# EAGLE design UP_Main_Board (EAGLE 9.6.2)
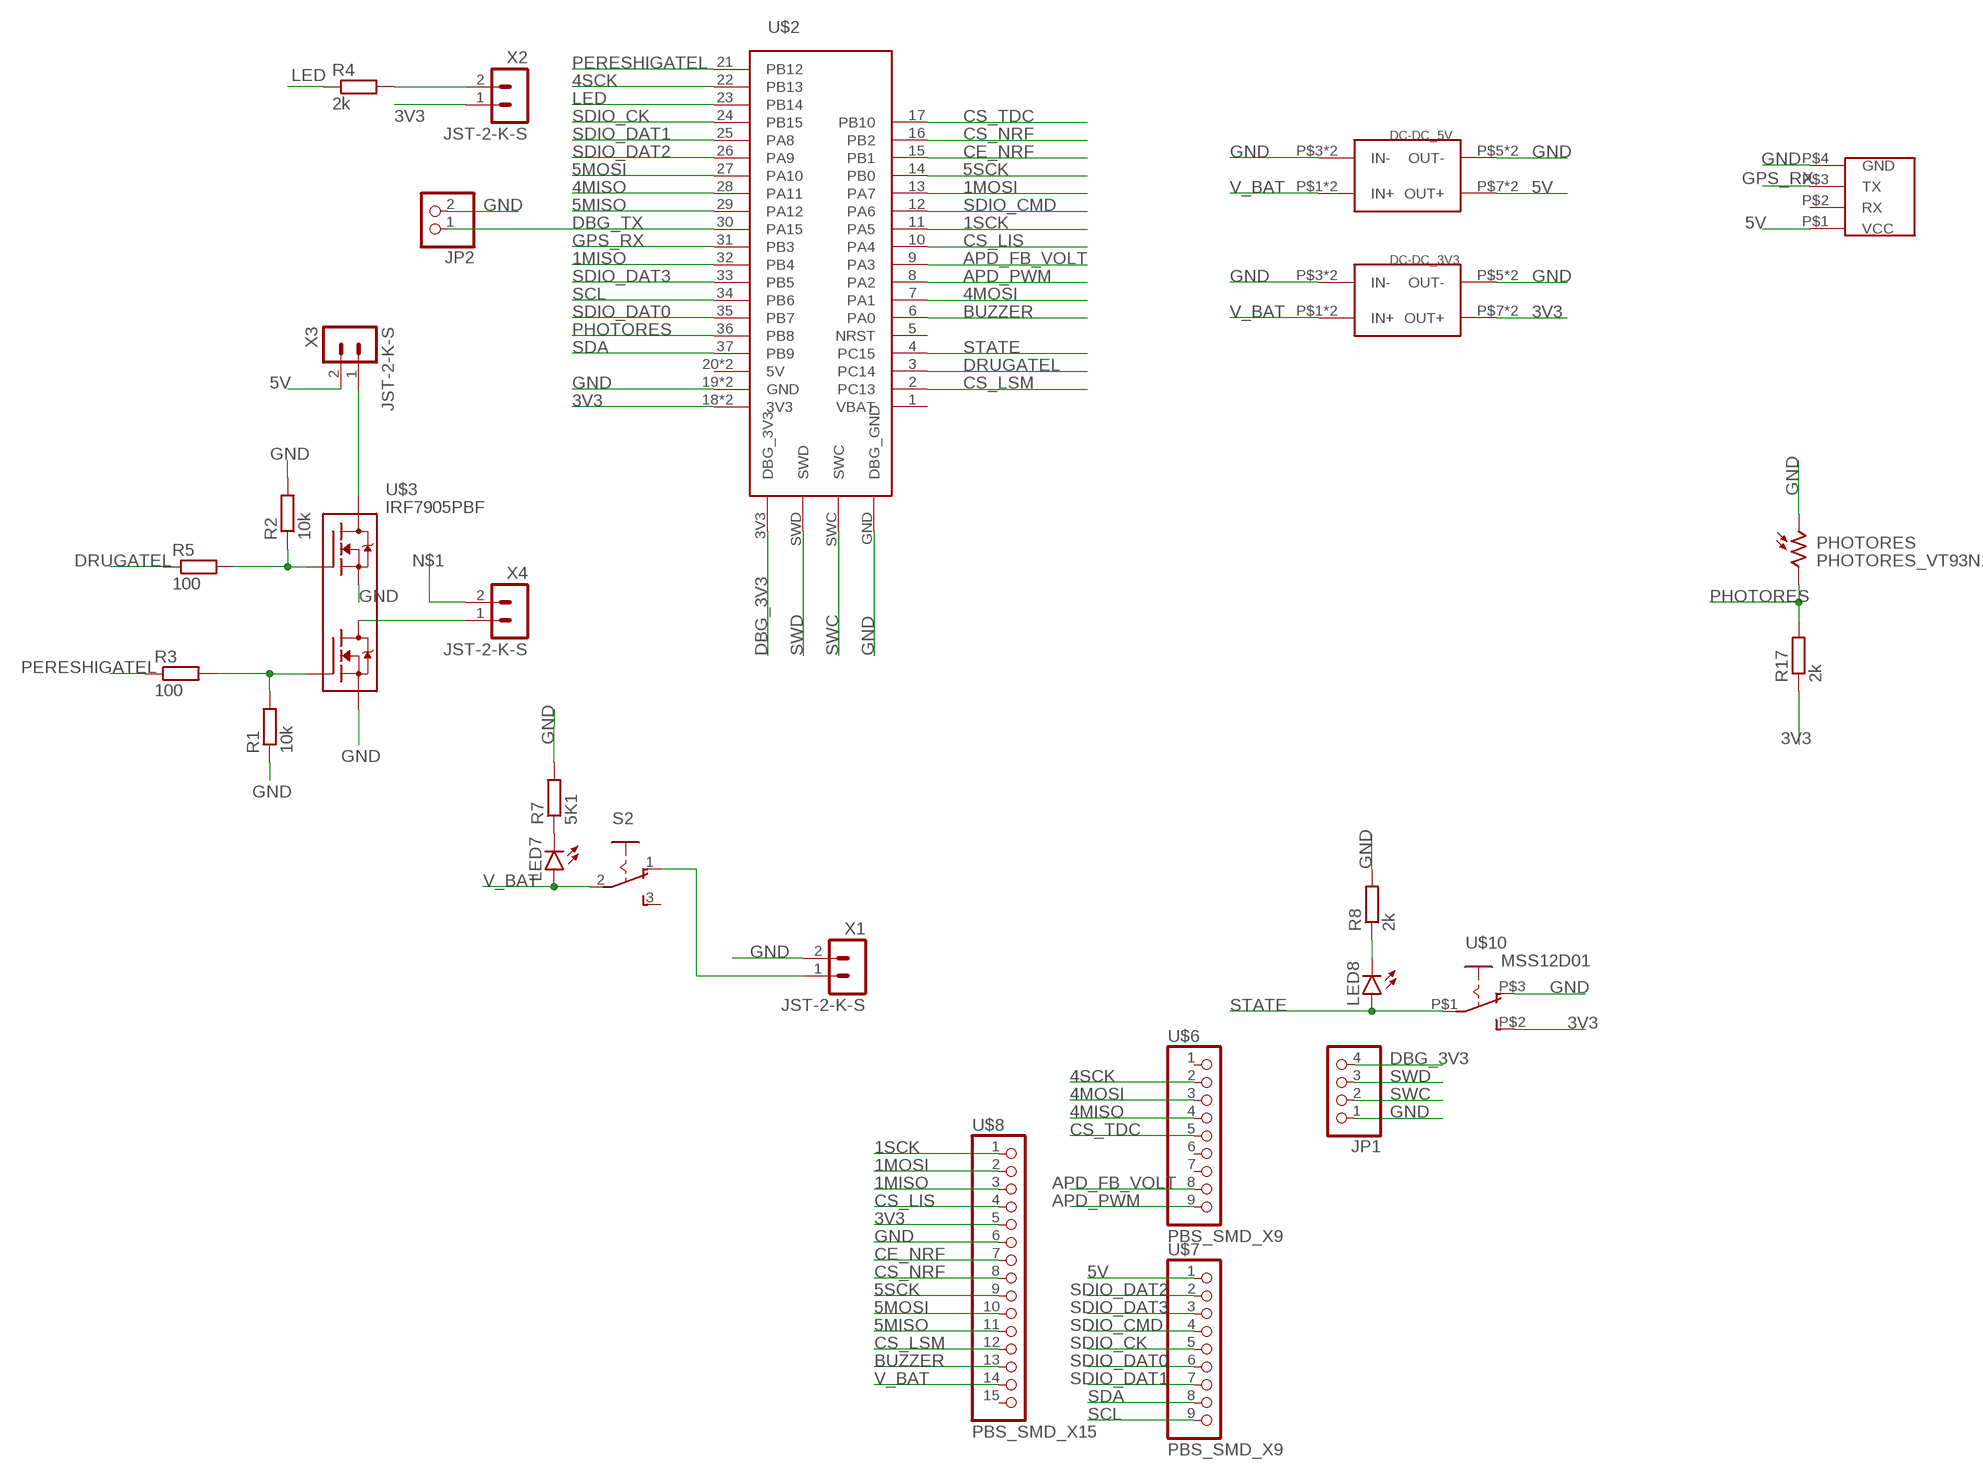
[diagram p0: schematic, sheet 1]

## Parts
DC-DC_3V3  MP1584-B  [MP1584-B]
DC-DC_5V  MP1584-B  [MP1584-B]
JP1  PINHD-1X4/90  [1X04/90]
JP2  PINHD-1X2  [1X02]
LED7  LEDSML0603  [SML0603]
LED8  LEDSML0603  [SML0603]
PHOTORES  PHOTORES_VT93N1  [PHOTORES_VT93N1_SMD]
R1  10k  R-EU_R0603  [R0603]
R2  10k  R-EU_R0603  [R0603]
R3  100  R-EU_R0603  [R0603]
R4  2k  R-EU_R0603  [R0603]
R5  100  R-EU_R0603  [R0603]
R7  5K1  R-EU_R0603  [R0603]
R8  2k  R-EU_R0603  [R0603]
R17  2k  R-EU_R0603  [R0603]
S2  UNICS-SWITCH  [UNICS-SWITCH]
U$1  GPS_NEO6M  [GPS_NEO6M_NEW]
U$2  STM32F401_BOARD  [STM32F401_BOARD]
U$3  IRF7905PBF  [SO8]
U$6  PBS_SMD_X9  [PBS_SMD_X9]
U$7  PBS_SMD_X9  [PBS_SMD_X9]
U$8  PBS_SMD_X15  [PBD_SMD_X15]
U$10  MSS12D01  [MSS12D01]
X1  JST-2-K-S  [B2B-PH-K-S]
X2  JST-2-K-S  [B2B-PH-K-S]
X3  JST-2-K-S  [B2B-PH-K-S]
X4  JST-2-K-S  [B2B-PH-K-S]

## Nets
1MISO: U$2.32(PB4) U$8.3
1MOSI: U$2.13(PA7) U$8.2
1SCK: U$2.11(PA5) U$8.1
3V3: DC-DC_3V3.P$7(OUT+) DC-DC_3V3.P$8(OUT+) R17.1 U$2.18(3V3) U$2.40(3V3) U$8.5 U$10.P$2(S) X2.1
4MISO: U$2.28(PA11) U$6.4
4MOSI: U$2.7(PA1) U$6.3
4SCK: U$2.22(PB13) U$6.2
5MISO: U$2.29(PA12) U$8.11
5MOSI: U$2.27(PA10) U$8.10
5SCK: U$2.14(PB0) U$8.9
5V: DC-DC_5V.P$7(OUT+) DC-DC_5V.P$8(OUT+) U$1.P$1(VCC) U$7.1 X3.2
APD_FB_VOLT: U$2.9(PA3) U$6.8
APD_PWM: U$2.8(PA2) U$6.9
BUZZER: U$2.6(PA0) U$8.13
CE_NRF: U$2.15(PB1) U$8.7
CS_LIS: U$2.10(PA4) U$8.4
CS_LSM: U$2.2(PC13) U$8.12
CS_NRF: U$2.16(PB2) U$8.8
CS_TDC: U$2.17(PB10) U$6.5
DBG_3V3: JP1.4 U$2.3V3(DBG_3V3)
DBG_TX: JP2.1 U$2.30(PA15)
DRUGATEL: R5.1 U$2.3(PC14)
GND: DC-DC_3V3.P$3(IN-) DC-DC_3V3.P$4(IN-) DC-DC_3V3.P$5(OUT-) DC-DC_3V3.P$6(OUT-) DC-DC_5V.P$3(IN-) DC-DC_5V.P$4(IN-) DC-DC_5V.P$5(OUT-) DC-DC_5V.P$6(OUT-) JP1.1 JP2.2 PHOTORES.P$1 R1.1 R2.2 R7.2 R8.2 U$1.P$4(GND) U$2.19(GND) U$2.39(GND) U$2.GND(DBG_GND) U$3.1(S2) U$3.3(S1) U$8.6 U$10.P$3(O) X1.2
GPS_RX: U$1.P$3(TX) U$2.31(PB3)
LED: R4.1 U$2.23(PB14)
N$1: S2.1(O) X1.1 X4.2
N$2: U$3.5(D1) U$3.6(D1) X3.1
N$3: R2.1 R5.2 U$3.4(G1)
N$4: LED7.C R7.1
N$5: R1.2 R3.2 U$3.2(G2)
N$6: R4.2 X2.2
N$8: U$3.7(D2) U$3.8(D2) X4.1
N$10: LED8.C R8.1
PERESHIGATEL: R3.1 U$2.21(PB12)
PHOTORES: PHOTORES.P$2 R17.2 U$2.36(PB8)
SCL: U$2.34(PB6) U$7.9
SDA: U$2.37(PB9) U$7.8
SDIO_CK: U$2.24(PB15) U$7.5
SDIO_CMD: U$2.12(PA6) U$7.4
SDIO_DAT0: U$2.35(PB7) U$7.6
SDIO_DAT1: U$2.25(PA8) U$7.7
SDIO_DAT2: U$2.26(PA9) U$7.2
SDIO_DAT3: U$2.33(PB5) U$7.3
STATE: LED8.A U$2.4(PC15) U$10.P$1(P)
SWC: JP1.2 U$2.SWC
SWD: JP1.3 U$2.SWD
V_BAT: DC-DC_3V3.P$1(IN+) DC-DC_3V3.P$2(IN+) DC-DC_5V.P$1(IN+) DC-DC_5V.P$2(IN+) LED7.A S2.2(P) U$8.14
Unconnected: S2.3(S) U$1.P$2(RX) U$2.1(VBAT) U$2.5(NRST) U$2.20(5V) U$2.38(5V) U$6.1 U$6.6 U$6.7 U$8.15

## Library data of the parts
DC-DC_3V3 DC-DC_5V = NEON-BLADE-2023:MP1584-B
JP1 = pinhead:PINHD-1X4: PIN HEADER
JP2 = pinhead:PINHD-1X2: PIN HEADER
LED7 LED8 = led:LED: LED OSRAM: - CHIPLED LG R971, LG N971, LY N971, LG Q971, LY Q971, LO R971, LY R971 LH N974, LH R974 LS Q976, LO Q976, LY Q976 LO Q996 - Hyper CHIPLED LW Q18S LB Q993, LB Q99A, LB R99A - SideLED LS A670, LO A670, LY A670, LG A670, LP A670 LB A673, LV A673, LT A673, LW A673 LH A674 LY A675 LS A676, LA A676, LO A676, LY A676, LW A676 LS A679, LY A679, LG A679 - Hyper Micro SIDELED® LS Y876, LA Y876, LO Y876, LY Y876 LT Y87S - SmartLED LW L88C, LW L88S LB L89C, LB L89S, LG L890 LS L89K, LO L89K, LY L89K LS L896, LA L896, LO L896, LY L896 - TOPLED LS T670, LO T670, LY T670, LG T670, LP T670 LSG T670, LSP T670, LSY T670, LOP T670, LYG T670 LG T671, LOG T671, LSG T671 LB T673, LV T673, LT T673, LW T673 LH T674 LS T676, LA T676, LO T676, LY T676, LB T676, LH T676, LSB T676, LW T676 LB T67C, LV T67C, LT T67C, LS T67K, LO T67K, LY T67K, LW E67C LS E67B, LA E67B, LO E67B, LY E67B, LB E67C, LV E67C, LT E67C LW T67C LS T679, LY T679, LG T679 LS T770, LO T770, LY T770, LG T770, LP T770 LB T773, LV T773, LT T773, LW T773 LH T774 LS E675, LA E675, LY E675, LS T675 LS T776, LA T776, LO T776, LY T776, LB T776 LHGB T686 LT T68C, LB T68C - Hyper Mini TOPLED® LB M676 - Mini TOPLED Santana® LG M470 LS M47K, LO M47K, LY M47K Source: http://www.osram.convergy.de LUXEON: - LUMILED® LXK2-PW12-R00, LXK2-PW12-S00, LXK2-PW14-U00, LXK2-PW14-V00 LXK2-PM12-R00, LXK2-PM12-S00, LXK2-PM14-U00 LXK2-PE12-Q00, LXK2-PE12-R00, LXK2-PE12-S00, LXK2-PE14-T00, LXK2-PE14-U00 LXK2-PB12-K00, LXK2-PB12-L00, LXK2-PB12-M00, LXK2-PB14-N00, LXK2-PB14-P00, LXK2-PB14-Q00 LXK2-PR12-L00, LXK2-PR12-M00, LXK2-PR14-Q00, LXK2-PR14-R00 LXK2-PD12-Q00, LXK2-PD12-R00, LXK2-PD12-S00 LXK2-PH12-R00, LXK2-PH12-S00 LXK2-PL12-P00, LXK2-PL12-Q00, LXK2-PL12-R00 Source: www.luxeon.com KINGBRIGHT: KA-3528ASYC Source: www.kingbright.com
PHOTORES = NEON-BLADE-2023:PHOTORES_VT93N1
R1-R5 R7 R8 R17 = rcl:R-EU_: RESISTOR, European symbol; SPICEPREFIX: R
S2 = cansat-lib:UNICS-SWITCH: SLIDING SWITCH Distributor Buerklin, 11G810
U$1 = NEON-BLADE-2024:GPS_NEO6M
U$2 = NEON-BLADE-2024:STM32F401_BOARD
U$3 = NEON-BLADE-2024:IRF7905PBF
U$6 U$7 = NEON-BLADE-2024:PBS_SMD_X9
U$8 = NEON-BLADE-2024:PBS_SMD_X15
U$10 = NEON-BLADE-2023:MSS12D01
X1-X4 = NEON-BLADE-2024:JST-2: JST PH series header 2.00mm pitch disconnectable crimp style connectors, vertical (side entry type), 2 pins

## Board
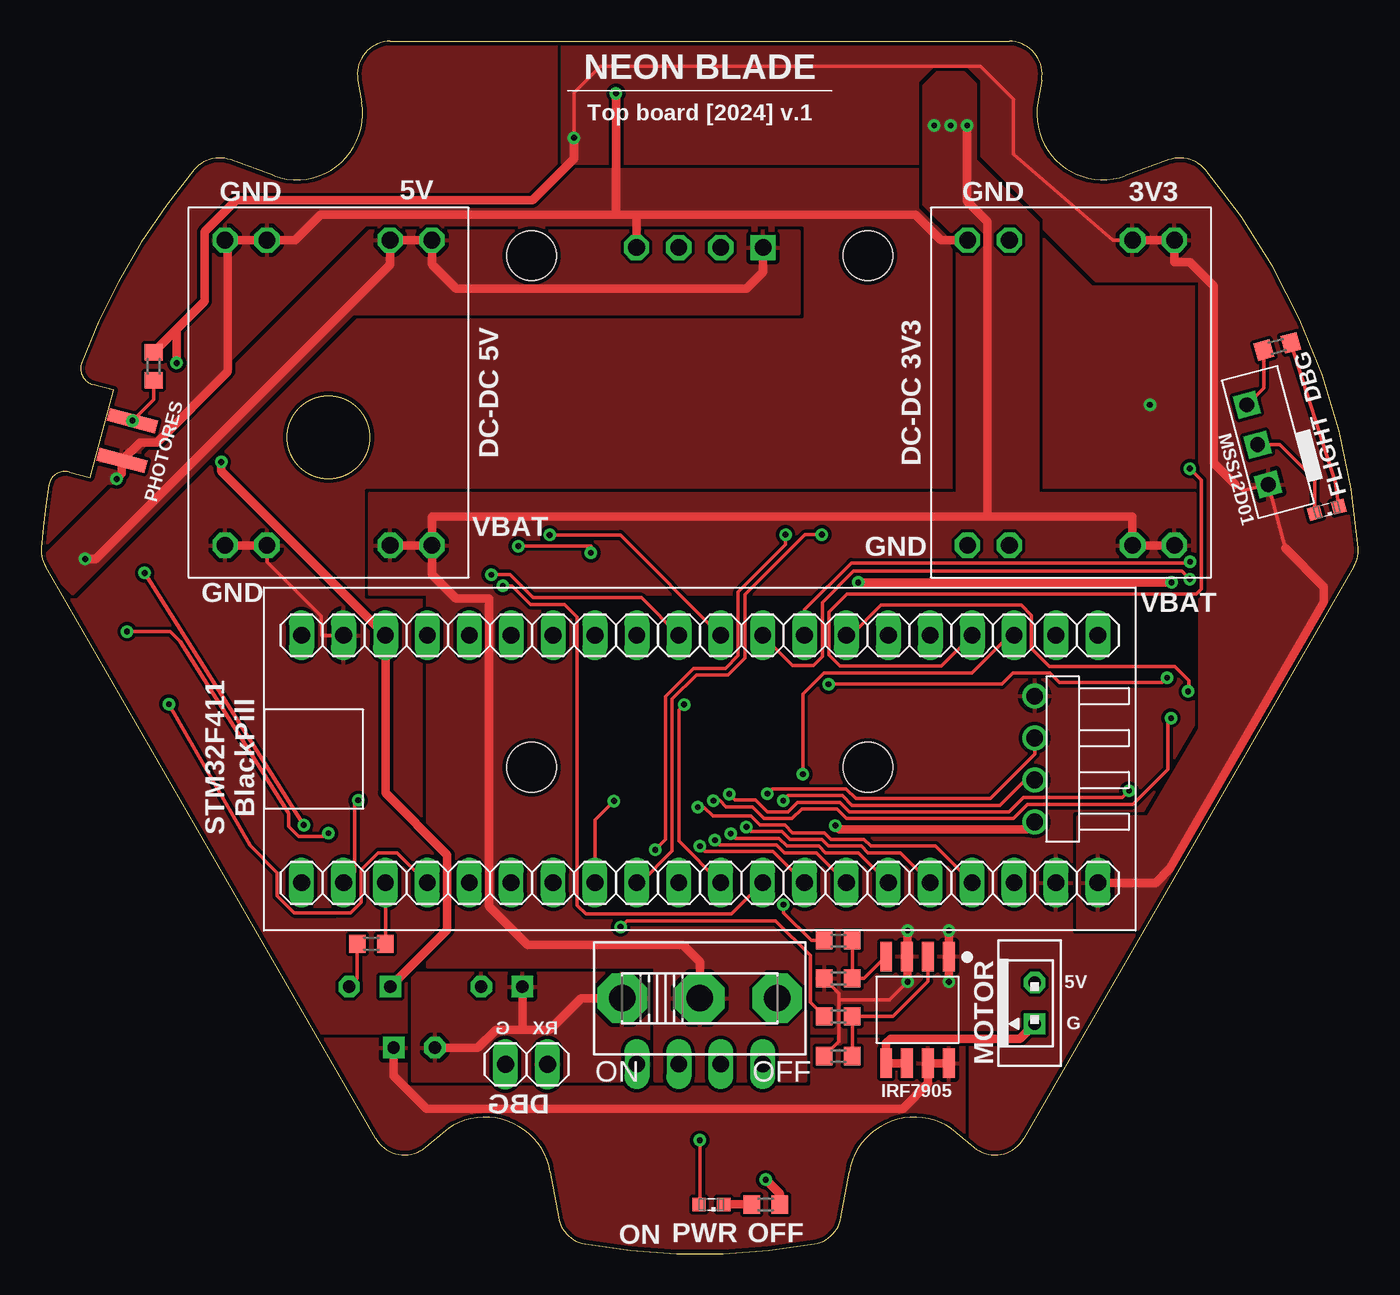
[diagram p1: board, top side]
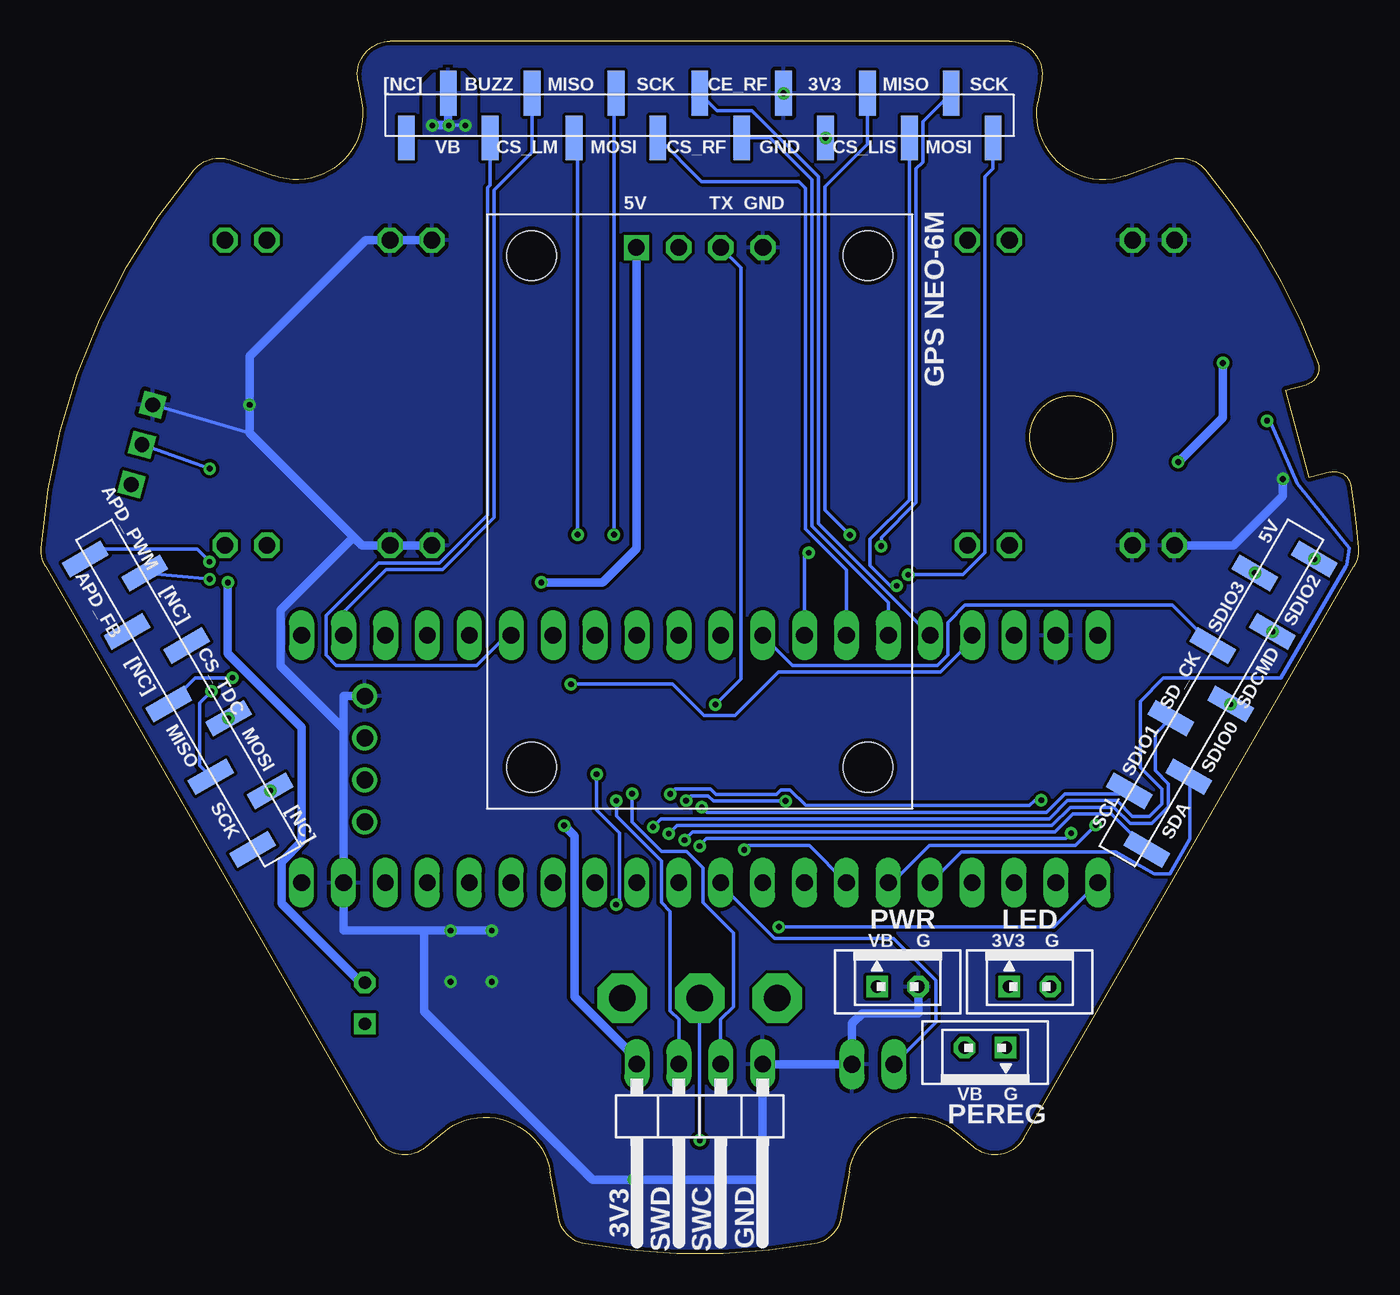
[diagram p2: board, bottom side, seen from below]

Size 79.81 x 73.48 mm. Coordinates in mm from the lower left corner, seen from the top.
Outline: 2.97,47.02 4.4,52.34 3.12,52.68 arc-96 2.44,54 arc-19 9.27,65.69 arc-70 11.48,66.28 14.11,65.33 arc120 19.42,69.78 19.18,71.13 arc-100 21.15,73.48 58.66,73.48 arc-100 60.63,71.13 60.39,69.78 arc120 65.7,65.33 68.33,66.28 arc-70 70.55,65.69 arc-36 79.81,42.77 arc-34 79.55,41.63 59.54,6.98 arc-100 56.52,6.45 55.47,7.33 arc120 48.96,4.96 48.48,2.21 arc-70 46.86,0.58 arc-20 32.96,0.58 arc-70 31.33,2.21 30.85,4.96 arc120 24.34,7.33 23.29,6.45 arc-100 20.27,6.98 0.27,41.63 arc-34 0,42.77 arc-5 0.45,46.57 arc-96 1.7,47.37 2.97,47.02
Outline: circle at 17.41,49.48 radius 2.5
Copper layers (1*16): Top 0.035mm / dielectric 1.5mm / Bottom 0.035mm
Design rules "default *": minimum track width 0.2mm, minimum drill 0.35mm, track to track 0.2mm, track to pad 0.2mm, pad to pad 0.2mm, via to via 0.2mm, smd to smd 0.2mm, copper to edge 10mil, drill to drill 6mil, minimum pad ring 10mil, minimum via ring 8mil, stop-mask expansion 4mil, vias tented up to drill 0mil, thermal gap 10mil

### Footprints (pad centres in the part's own frame; a part is rotated, then mirrored left to right if it is on the bottom)
MP1584-B = drill 1.016 octagon: P$1 1.95,2.23; P$2 1.95,4.77; P$3 1.95,12.23; P$4 1.95,14.77; P$5 20.45,14.77; P$6 20.45,12.23; P$7 20.45,4.77; P$8 20.45,2.23
1X04/90 = drill 1.016 long: 1 -3.81,-3.81; 2 -1.27,-3.81; 3 1.27,-3.81; 4 3.81,-3.81
1X02 = drill 1.016 long: 1 -1.27,0; 2 1.27,0
SML0603 = smd 0.8 x 0.8: A 0.75,0; C -0.75,0
PHOTORES_VT93N1_SMD = smd 0.8 x 3: P$1 -1.25,0; P$2 1.25,0
R0603 = smd 1 x 1.1: 1 -0.85,0; 2 0.85,0
UNICS-SWITCH = drill 1.6 pad 3 octagon: 1 -4.7,0; 2 0,0; 3 4.7,0
GPS_NEO6M_NEW = drill 1.016 square: P$1 -16,-3.84 | drill 1.016 octagon: P$2 -16,-1.27; P$3 -16,1.27; P$4 -16,3.84 | hole 3: -15.5,-10.2; -15.5,10.2; 15.5,-10.2; 15.5,10.2
STM32F401_BOARD = drill 1.016 long: 1 24.13,7.5; 2 21.59,7.5; 3 19.05,7.5; 4 16.51,7.5; 5 13.97,7.5; 6 11.43,7.5; 7 8.89,7.5; 8 6.35,7.5; 9 3.81,7.5; 10 1.27,7.5; 11 -1.27,7.5; 12 -3.81,7.5; 13 -6.35,7.5; 14 -8.89,7.5; 15 -11.43,7.5; 16 -13.97,7.5; 17 -16.51,7.5; 18 -19.05,7.5; 19 -21.59,7.5; 20 -24.13,7.5; 21 -24.13,-7.5; 22 -21.59,-7.5; 23 -19.05,-7.5; 24 -16.51,-7.5; 25 -13.97,-7.5; 26 -11.43,-7.5; 27 -8.89,-7.5; 28 -6.35,-7.5; 29 -3.81,-7.5; 30 -1.27,-7.5; 31 1.27,-7.5; 32 3.81,-7.5; 33 6.35,-7.5; 34 8.89,-7.5; 35 11.43,-7.5; 36 13.97,-7.5; 37 16.51,-7.5; 38 19.05,-7.5; 39 21.59,-7.5; 40 24.13,-7.5 | drill 1.016: 3V3 20.3,-3.81; GND 20.3,3.81; SWC 20.3,1.27; SWD 20.3,-1.27
SO8 = smd 0.72 x 1.78: 1 -1.905,-3.23; 2 -0.635,-3.23; 3 0.635,-3.23; 4 1.905,-3.23; 5 1.905,3.23; 6 0.635,3.23; 7 -0.635,3.23; 8 -1.905,3.23
PBS_SMD_X9 = smd 1.02 x 2.7: 1 -10.16,1.35; 2 -7.62,-1.35; 3 -5.08,1.35; 4 -2.54,-1.35; 5 0,1.35; 6 2.54,-1.35; 7 5.08,1.35; 8 7.62,-1.35; 9 10.16,1.35
PBD_SMD_X15 = smd 1.02 x 2.7: 1 -17.78,1.35; 2 -15.24,-1.35; 3 -12.7,1.35; 4 -10.16,-1.35; 5 -7.62,1.35; 6 -5.08,-1.35; 7 -2.54,1.35; 8 0,-1.35; 9 2.54,1.35; 10 5.08,-1.35; 11 7.62,1.35; 12 10.16,-1.35; 13 12.7,1.35; 14 15.24,-1.35; 15 17.78,1.35
MSS12D01 = drill 0.9 square: P$1 0,0; P$2 2.5,0; P$3 -2.5,0
B2B-PH-K-S = drill 0.75 pad 1.3 square: 1 1.25,0 | drill 0.75 pad 1.3 octagon: 2 -1.25,0

### Placement (x,y rotation side)
DC-DC_3V3  70.91,40.98 90 top
DC-DC_5V  25.91,40.98 90 top
JP1  39.91,7.68 180 bottom
JP2  29.41,11.48 0 top
LED7  40.61,2.98 180 top
LED8  77.91,45.08 195 top
PHOTORES  5.21,49.28 75 top
R1  48.31,11.98 0 top
R2  48.31,16.68 180 top
R3  48.31,14.38 0 top
R4  20.01,18.78 180 top
R5  48.31,18.98 0 top
R7  43.91,2.98 0 top
R8  74.91,54.98 195 top
R17  6.81,53.78 270 top
S2  39.91,15.48 0 top
U$1  39.91,44.98 270 bottom
U$2  39.91,29.98 0 top
U$3  53.11,14.78 180 top
U$6  70.91,33.98 120 bottom
U$7  8.91,33.98 240 bottom
U$8  39.91,68.98 180 bottom
U$10  73.71,49.03 285 top
X1  27.91,16.18 180 bottom
X2  19.91,16.18 180 bottom
X3  60.21,15.18 270 top
X4  22.61,12.48 0 bottom

### Tracks (layer width: path | path; a pad name or v marks a point on that pad's centre or on a via)
1MISO  (via drill 0.35)
  Top 0.2: v27.97,40.47 28.52,40.47 29.64,39.35 31.71,39.35 32.48,38.57 32.48,21.1 33.01,20.58 41.82,20.58 U$2.32
  Bottom 0.2: U$8.3 27.21,45.68 29.58,43.3 29.58,41.69 28.36,40.47 v27.97,40.47
1MOSI  (via drill 0.35)
  Top 0.2: v33.31,42.48 33.31,42.88 v28.91,42.88
  Bottom 0.2: U$8.2 26.4,68.6 26.4,66.15 26.81,65.74 26.81,45.51 28.91,43.41 v28.91,42.88 | v33.31,42.48 33.56,42.23 U$2.13
1SCK  (via drill 0.35)
  Top 0.2: v27.27,41.15 28.41,41.15 29.8,39.75 36.36,39.75 U$2.11
  Bottom 0.2: v27.27,41.15 23.95,41.15 22.61,42.49 22.61,65.28 22.13,65.76 U$8.1
3V3  (via drill 0.35)
  Top 0.2: 68.68,61.41 DC-DC_3V3.P$8 | DC-DC_3V3.P$7 64.96,61.43 58.91,66.64 58.91,69.98 56.91,71.98 33.91,71.98 32.29,70.36 U$8.5 | 72.37,46.61 72.83,46.23 U$10.P$2 75.38,42.75
  Top 0.5: DC-DC_3V3.P$7 DC-DC_3V3.P$8 | R17.1 8.21,56.03 | 8.21,56.03 9.89,57.71 9.89,61.92 11.81,63.84 29.77,63.84 32.29,66.36 U$8.5 | v10.91,47.98 10.91,47.43 U$2.18 20.86,27.93 24.61,24.17 24.61,19.63 X2.1 | v8.21,53.98 8.21,56.03 | U$2.40 67.54,22.48 68.4,23.34 77.73,39.49 77.73,40.4 75.38,42.75 | 68.68,61.41 68.68,60.08 69.61,60.08 71.06,58.63 71.06,47.93 72.37,46.61
  Bottom 0.5: v10.91,47.98 8.21,50.68 v8.21,53.98
  other vias: 32.29,67.63
  pour Top (rank 2): 77.01,58.98 63.91,58.98 56.81,66.08 31.61,66.08 31.61,73.48 77.01,73.48
  pour Top (rank 2): 70.21,58.88 70.21,31.76 67.09,26.48 62.81,26.48 62.81,19.68 85.41,19.68 85.41,58.88
4MISO  (via drill 0.35)
  Top 0.2: U$2.28 33.56,26.28 v34.71,27.43 | U$6.4 68.27,32.25 68.27,29.35 66.14,27.23 59.76,27.23 59.31,26.78 58.91,26.38 48.81,26.38 48.23,26.95 46.09,26.95 45.51,26.38 43.81,26.38 43.11,27.08 41.51,27.08 41.13,27.45 v40.74,27.45
  Bottom 0.2: v40.74,27.45 40.44,27.75 39.41,27.75 39.08,27.43 v34.71,27.43
  other vias: 68.47,32.45
4MOSI  (via drill 0.35)
  Top 0.2: U$2.7 49.07,37.48 50.9,39.3 59.4,39.3 60.02,38.68 60.02,36.66 61.11,35.58 68.71,35.58 69.54,34.75 69.54,34.1 v69.51,34.08
  Bottom 0.2: U$6.3 70.21,29.58 70.21,33.37 v69.51,34.08
4SCK  (via drill 0.35)
  Top 0.2: U$2.22 18.98,23.14 18.98,27.25 v19.21,27.48 | U$6.2 65.52,27.64 59.51,27.64 58.64,26.78 48.98,26.78 48.4,27.35 45.82,27.35 45.24,26.78 44.01,26.78 43.28,27.5 42.04,27.5 v41.69,27.85
  Bottom 0.2: v19.21,27.48 19.61,27.48 19.93,27.15 33.47,27.15 34.43,28.11 34.99,28.11 35.27,27.83 38.92,27.83 39.24,28.15 41.39,28.15 v41.69,27.85
  other vias: 65.93,28.05
5MISO  (via drill 0.35)
  Top 0.2: v47.31,43.58 46.27,43.58 42.64,39.94 42.64,36.09 41.63,35.08 39.71,35.08 38.24,33.61 38.24,24.41 36.31,22.48 U$2.29
  Bottom 0.2: v47.31,43.58 47.31,66.38 47.91,66.98 47.91,67.25 U$8.11
5MOSI  (via drill 0.35)
  Top 0.2: v45.11,43.58 45.11,42.98 42.24,40.11 42.24,36.25 41.46,35.48 39.54,35.48 37.84,33.77 37.84,25.1 v37.21,24.47
  Bottom 0.2: U$8.10 45.11,70.21 v45.11,43.58 | U$2.27 33.27,24.73 36.95,24.73 v37.21,24.47
5SCK
  Bottom 0.2: U$8.9 39.8,64.98 33.91,64.98 33.51,64.58 33.51,43.92 31.02,41.42 U$2.14
5V  (via drill 0.35)
  Top 0.5: U$1.P$1 43.75,59.48 42.74,58.47 25.13,58.47 23.68,59.93 DC-DC_5V.P$8 DC-DC_5V.P$7 21.14,59.93 3.31,42.1 U$7.1 | v49.51,40.68 v68.51,40.68
  Bottom 0.5: U$1.P$1 43.75,42.74 45.81,40.68 v49.51,40.68 | v68.51,40.68 68.51,36.38 64.02,31.89 64.02,24.97 65.25,23.74 65.25,21.21 60.46,16.43 X3.2
  other vias: 2.66,42.1
  pour Top: 19.91,61.98 45.91,61.98 45.91,56.98 18.91,56.98 1.91,39.98 -0.09,41.98
APD_FB_VOLT  (via drill 0.35)
  Top 0.2: U$2.9 45.54,35.65 46.78,35.65 47.33,36.2 47.33,39.47 49.21,41.35 69.13,41.35 v69.61,40.88
  Bottom 0.2: v69.61,40.88 U$6.8
APD_PWM  (via drill 0.35)
  Top 0.2: U$2.8 46.26,39.03 49.09,41.86 69.55,41.86 v69.62,41.93
  Bottom 0.2: v69.62,41.93 70.37,42.69 76.67,42.69 77.16,42.2 U$6.9
BUZZER
  Bottom 0.2: U$8.13 52.61,64.76 52.76,64.61 52.76,44.77 55.66,41.86 59.37,41.86 62.56,38.68 62.56,36.27 61.94,35.65 53.44,35.65 51.61,37.48 U$2.6
CE_NRF
  Bottom 0.2: U$2.15 28.48,39.45 33.11,44.08 33.11,65.09 35.65,67.63 U$8.7
CS_LIS  (via drill 0.35)
  Top 0.2: v30.81,43.55 35.1,43.55 U$2.10
  Bottom 0.2: U$8.4 29.75,67.24 32.31,64.67 32.31,45.06 v30.81,43.55
CS_LSM
  Bottom 0.2: U$2.2 61.5,38.88 58.91,41.46 55.5,41.46 52.36,44.6 52.36,64.44 50.07,66.74 U$8.12
CS_NRF
  Bottom 0.2: U$8.8 38.86,69.28 36.73,69.28 32.71,65.25 32.71,44.25 U$2.16
CS_TDC  (via drill 0.35)
  Top 0.2: v68.23,34.9 67.94,34.61 61.71,34.61 61.14,35.18 58.87,35.18 58.21,34.51 v47.71,34.51
  Bottom 0.2: v47.71,34.51 41.55,34.51 39.64,32.6 37.78,32.6 35.13,35.25 25.33,35.25 23.4,37.19 U$2.17 | v68.23,34.9 70.48,34.9 U$6.5
DBG_3V3  (via drill 0.35)
  Top 0.5: v48.13,25.95 48.38,25.7 59.74,25.7 U$2.3V3
  Bottom 0.5: v48.13,25.95 47.51,25.33 47.51,15.58 43.72,11.79 JP1.4
DBG_TX
  Bottom 0.2: JP2.1 25.61,14.01 25.61,16.57 28.16,19.12 35.39,19.12 38.64,22.37 U$2.30
DRUGATEL  (via drill 0.35)
  Top 0.2: R5.1 46.67,18.98 44.98,20.66 v44.98,21.15 | v46.16,29.05 46.16,33.92 47.44,35.2 56.41,35.2 58.68,37.48 U$2.3
  Bottom 0.2: v46.16,29.05 46.16,26.89 44.78,25.51 44.78,21.34 v44.98,21.15
GND  (via drill 0.35)
  Top 0.2: DC-DC_5V.P$3 13.68,41.92 16.96,38.63 17.01,37.48 U$2.19 | R8.2 74.09,52.47 U$10.P$3 | R2.2 48.36,15.78 48.36,15.38 | 48.36,15.38 48.36,12.88 R1.1 | 48.36,15.38 51.41,15.38 v52.51,16.48 | DC-DC_5V.P$5 11.31,61.26
  Top 0.5: DC-DC_5V.P$4 DC-DC_5V.P$3 | DC-DC_5V.P$5 DC-DC_5V.P$6 15.38,61.43 16.93,62.98 34.82,62.98 34.83,62.98 | U$8.6 34.83,62.98 | DC-DC_3V3.P$5 54.54,61.43 52.99,62.98 36.07,62.98 | v43.91,4.48 44.76,3.63 R7.2 | v55.01,16.48 U$3.1 v55.01,19.58 | v52.51,19.58 52.51,18.04 U$3.3 52.51,17.97 v52.51,16.48 | 34.83,62.98 36.07,62.98 | 36.07,62.98 U$1.P$4 | 11.31,61.26 11.31,53.46 7.02,49.17 5.98,49.17 PHOTORES.P$1 4.88,47.27 v4.57,46.95
  Bottom 0.2: 67.19,49.74 U$10.P$3
  Bottom 0.5: 60.88,43.43 60.38,42.93 DC-DC_3V3.P$3 DC-DC_3V3.P$4 | 60.88,43.43 67.19,49.74 v67.19,51.44 67.19,54.39 60.16,61.43 DC-DC_3V3.P$6 DC-DC_3V3.P$5 | v52.51,19.58 v55.01,19.58 56.61,19.58 | 56.61,19.58 61.5,19.58 U$2.39 61.5,31.8 | U$2.GND 61.5,33.79 61.5,31.8 | 61.5,31.8 65.31,35.61 65.31,38.99 60.88,43.43 | 56.61,19.58 56.61,14.68 46.41,4.48 v43.91,4.48 36.11,4.48 36.1,4.49 JP1.1 JP2.2 30.68,13.96 30.06,14.58 26.66,14.58 X1.2 | v4.57,46.95 4.57,45.92 7.56,42.93 DC-DC_5V.P$4
  other vias: 34.83,70.33
  pour Top (rank 3): -2.09,78.98 80.31,78.98 80.31,-0.02 -2.09,-0.02
  pour Bottom (rank 2): -1.69,77.98 80.81,77.98 80.81,-2.32 -1.69,-2.32
GPS_RX  (via drill 0.35)
  Top 0.2: U$2.31 38.64,25.02 38.64,32.96 v38.96,33.28
  Bottom 0.2: U$1.P$3 37.41,59.75 37.41,34.83 v38.96,33.28
LED
  Top 0.2: R4.1 U$2.23
N$1
  Top 0.5: S2.1 32.71,15.48 30.81,13.58 29.16,13.58 | X1.1 29.16,13.58 | X4.2 26.46,12.48 27.56,13.58 29.16,13.58
  pour Top: 22.51,16.98 22.51,10.48 36.81,10.48 36.81,16.98
N$2
  Top 0.5: U$3.6 U$3.5 51.2,12.77 51.46,13.03 59.31,13.03 X3.1
N$3
  Top 0.2: R5.2 R2.1 49.87,16.68 U$3.4
N$4
  Top 0.5: LED7.C R7.1
N$5
  Top 0.2: R1.2 R3.2 51.61,14.38 53.74,16.51 U$3.2
N$6
  Top 0.2: R4.2 19.16,16.68 X2.2
N$8
  Top 0.5: X4.1 21.36,10.78 23.36,8.78 52.21,8.78 53.74,10.31 U$3.7 U$3.8
  pour Top (rank 2): 15.91,12.98 55.91,12.98 55.91,-1.02 15.91,-1.02
N$10
  Top 0.2: LED8.C 78.42,46.76 R8.1
PERESHIGATEL  (via drill 0.35)
  Top 0.2: R3.1 46.61,15.23 46.61,18.08 44.51,20.18 35.48,20.18 v35.11,19.8
  Bottom 0.2: U$2.21 18.45,19.8 v35.11,19.8
PHOTORES  (via drill 0.35)
  Top 0.2: R17.2 6.81,51.76 PHOTORES.P$2 | v42.73,25.85 43.01,25.58 44.89,25.58 45.36,25.1 47.3,25.1 47.7,24.7 49.7,24.7 50.1,24.3 52.08,24.3 53.88,22.5 U$2.36
  Bottom 0.2: PHOTORES.P$2 5.25,50.2 3.71,46.68 0.54,42.76 0.68,41.75 0.74,41.64 4.68,34.88 11.81,34.88 13.21,33.48 13.21,29.48 11.91,28.18 11.91,27.24 12.65,26.5 13.68,26.5 14.64,27.45 17.62,27.45 18.72,26.35 42.24,26.35 v42.73,25.86 v42.73,25.85
  other vias: 5.53,50.48
SCL  (via drill 0.35)
  Top 0.2: v40.83,25.05 41.11,24.78 44.56,24.78 45.03,24.3 46.97,24.3 U$2.34
  Bottom 0.2: U$7.9 14.97,26.65 17.29,26.65 18.39,25.55 40.33,25.55 v40.83,25.05
SDA  (via drill 0.35)
  Top 0.2: v39.79,27.05 40.18,27.05 40.7,26.53 43.01,26.53 43.57,25.98 45.06,25.98 45.53,25.5 47.47,25.5 47.87,25.1 49.87,25.1 50.27,24.7 54.19,24.7 U$2.37
  Bottom 0.2: U$7.8 14.08,27.85 17.78,27.85 18.89,26.75 39.48,26.75 v39.79,27.05
SDIO_CK  (via drill 0.35)
  Top 0.2: U$2.24 21.57,24.3 20.42,24.3 19.38,23.26 19.38,21.27 18.76,20.65 17.91,20.65 17.88,20.65 15.33,20.65 14.31,21.68 14.31,23.08 12.65,24.74 U$7.5
  other vias: 7.74,33.3
SDIO_CMD
  Bottom 0.2: U$2.12 34.27,35.65 25.5,35.65 24.87,36.27 24.87,38.26 23.84,39.3 11.25,39.3 U$7.4
SDIO_DAT0  (via drill 0.35)
  Top 0.2: U$2.35 51.34,22.5 49.54,24.3 47.54,24.3 47.14,24.7 45.2,24.7 44.72,25.18 42.06,25.18 v41.78,25.45
  Bottom 0.2: v41.78,25.45 v41.78,25.46 41.29,25.95 18.56,25.95 17.45,27.05 14.8,27.05 13.83,26.08 12.51,26.08 11.51,27.08 11.51,28.48 12.31,29.28 12.31,31.49 U$7.6
SDIO_DAT1
  Bottom 0.2: U$2.25 24.06,24.35 14.68,24.35 12.36,23.02 11.42,23.02 10.21,25.13 10.21,28.83 U$7.7
SDIO_DAT2  (via drill 0.35)
  Top 0.2: v15.91,25.98 U$7.2
  Bottom 0.2: U$2.26 28.27,22.48 26,24.75 17.13,24.75 v15.91,25.98
  other vias: 6.27,41.25
SDIO_DAT3  (via drill 0.35)
  Top 0.2: U$7.3 7.82,37.7 8.4,37.11 | 8.4,37.11 | 8.4,37.11 14.95,26.74 15.01,26.65 15.01,25.88 15.58,25.3 17.23,25.3 v17.41,25.48 | v39.92,24.69 40.24,24.38 44.36,24.38 U$2.33
  Bottom 0.2: v17.41,25.48 17.73,25.15 39.51,25.15 39.92,24.74 v39.92,24.69
  other vias: 5.2,37.7
STATE  (via drill 0.35)
  Top 0.2: LED8.A 77.18,46.9 75.06,49.03 U$10.P$1 | U$2.4 54.54,35.6 48.41,35.6 47.73,36.28 47.73,38.88 48.83,39.98 70.01,39.98 70.31,40.28 70.31,46.88 v69.61,47.58
  Bottom 0.2: v69.61,47.58 U$10.P$1
SWC  (via drill 0.35)
  Top 0.2: U$2.SWC 60.21,30.28 57.51,27.58 49.37,27.58 48.77,28.18 44.31,28.18 v44.01,27.88
  Bottom 0.2: JP1.2 38.64,14.19 37.86,14.97 37.86,19.43 39.71,21.28 39.71,23.38 40.71,24.38 42.21,24.38 44.01,26.17 v44.01,27.88
SWD  (via drill 0.35)
  Top 0.2: U$2.SWD 59.64,28.71 58.11,27.18 49.14,27.18 48.56,27.75 45.26,27.75 v44.96,27.45
  Bottom 0.2: JP1.3 41.18,14.19 41.71,14.72 41.71,20.74 42.24,21.27 42.24,23.79 44.96,26.51 v44.96,27.45
V_BAT  (via drill 0.35)
  Top 0.2: v39.91,6.88 39.91,3.03 LED7.A
  Top 0.5: DC-DC_5V.P$1 DC-DC_5V.P$2 | S2.2 39.91,17.68 38.88,18.7 29.48,18.7 27.15,21.03 27.15,39.71 25.14,39.71 23.68,41.17 DC-DC_5V.P$1 | DC-DC_5V.P$1 23.68,44.68 57.35,44.68 | DC-DC_3V3.P$1 DC-DC_3V3.P$2 66.14,44.68 57.35,44.68 | v56.11,68.38 56.11,63.78 57.35,62.53 57.35,44.68
  Bottom 0.2: v54.11,68.38 v55.11,68.38 v56.11,68.38 | S2.2 v39.91,6.88
  Bottom 0.5: v56.11,68.38 55.15,68.38 U$8.14
  pour Top: 19.91,46.08 19.91,39.98 23.41,39.98 23.41,17.38 37.21,17.38 37.21,10.48 46.31,10.48 46.31,20.78 32.61,20.78 32.61,39.98 69.91,39.98 69.91,46.08
  pour Top: 60.41,46.08 60.41,62.48 56.61,66.28 56.61,70.88 55.71,71.78 54.51,71.78 53.51,70.78 53.51,63.58 55.51,61.58 55.51,46.08
  pour Bottom: 54.51,71.78 55.71,71.78 56.61,70.88 56.61,67.78 53.51,67.78 53.51,70.78

### Text on the board
tPlace: NEON BLADE | Top board [2024] v.1 | GND | 5V | GND | 3V3 | DBG | MSS12D01 | FLIGHT | VBAT | GND | GND | VBAT | IRF7905 | ON | PWR | OFF
bPlace: GND | SWC | SWD | 3V3
tNames: DC-DC 5V | DC-DC 3V3 | STM32F411 / BlackPill | MOTOR | 5V | G | G | RX | DBG
bNames: SCK | MISO | 3V3 | CE_RF | SCK | MISO | BUZZ | [NC] | MOSI | CS_LIS | GND | CS_RF | MOSI | CS_LM | VB | GND | TX | 5V | GPS NEO-6M | APD_PWM | 5V | SDIO2 | SDIO3 | APD_FB | [NC] | SDСMD | SD_CK | CS_TDC | [NC] | SDIO0 | SDIO1 | MOSI | MISO | SDA | SCL | [NC] | SCK | LED | PWR | G | 3V3 | G | VB | G | VB | PEREG